# Altium schematic sheet reference_voltage.SchDoc
size A3; SheetNumber: 3; SheetTotal: 5
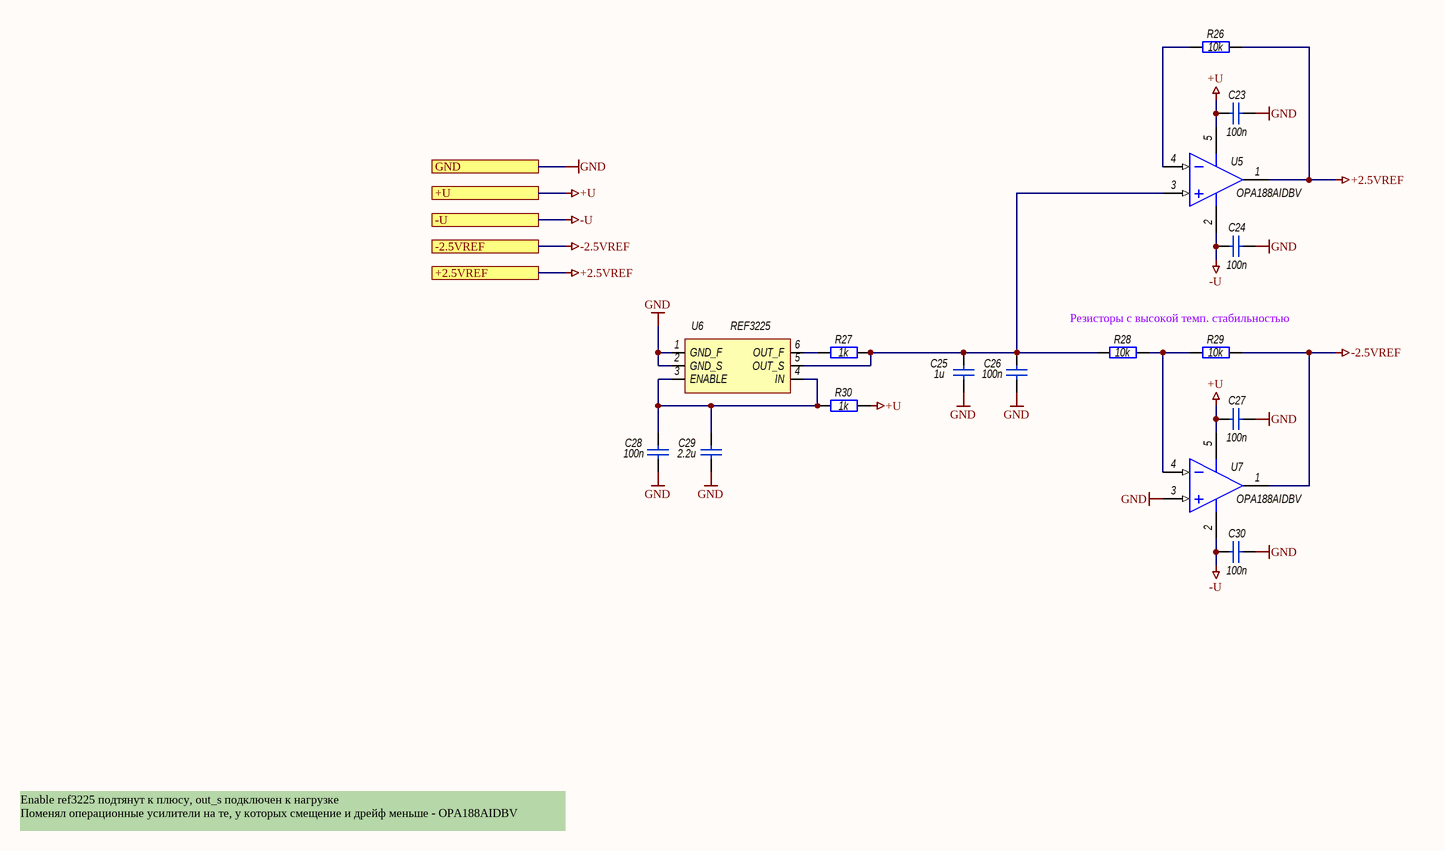
[diagram p0: reference_voltage.SchDoc]

## Parts
C23  100n  [CAP_0603]
C24  100n  [CAP_0603]
C25  1u  [CAP_0603]
C26  100n  [CAP_0603]
C27  100n  [CAP_0603]
C28  100n  [CAP_0603]
C29  2.2u  [CAP_0603]
C30  100n  [CAP_0603]
R26  10k  [RES_0603]
R27  1k  [RES_0603]
R28  10k  [RES_0603]
R29  10k  [RES_0603]
R30  1k  [RES_0603]
U5  OPA188AIDBV  [sot235]
U6  REF3225  [SOT236]
U7  OPA188AIDBV  [sot235]

## Ports
+2.5VREF, +U, -2.5VREF, -U, GND

## Nets
+2.5VREF: R26.2 U5.1(OUT) ; port +2.5VREF
+U: C23.1 C27.1 R30.2 U5.5(V+) U7.5(V+) ; port +U
-2.5VREF: R29.2 U7.1(OUT) ; port -2.5VREF
-U: C24.1 C30.1 U5.2(V-) U7.2(V-) ; port -U
GND: C23.2 C24.2 C25.1 C26.1 C27.2 C28.1 C29.1 C30.2 U6.1(GND_F) U6.2(GND_S) U7.3(IN+) ; port GND
NetC25_2: C25.2 C26.2 R27.2 R28.1 U5.3(IN+) U6.5(OUT_S)
NetC28_2: C28.2 C29.2 R30.1 U6.3(ENABLE) U6.4(IN)
NetR26_1: R26.1 U5.4(IN-)
NetR27_1: R27.1 U6.6(OUT_F)
NetR28_2: R28.2 R29.1 U7.4(IN-)

## Notes on the sheet
- Резисторы с высокой темп. стабильностью
- Enable ref3225 подтянут к плюсу, out_s подключен к нагрузке
  Поменял операционные усилители на те, у которых смещение и дрейф меньше - OPA188AIDBV

## Library data of the parts
C23-C30 = Capacitor: Конденсатор
R26 R28 R29 = Resisitor: Резистор; ValueBOM: 0805 10k 0.125; MarkPCB: 103; ValueSCH: 10k
R27 R30 = Resisitor: Резистор
U5 U7 = OPAMP SOT235: Операционный усилитель
U6 = REF32xx: Источник опорного напряжения; ValueBOM: REF32xx; ValueSCH: REF32xx; HelpURL: C:\Datasheets\REF32xx.pdf